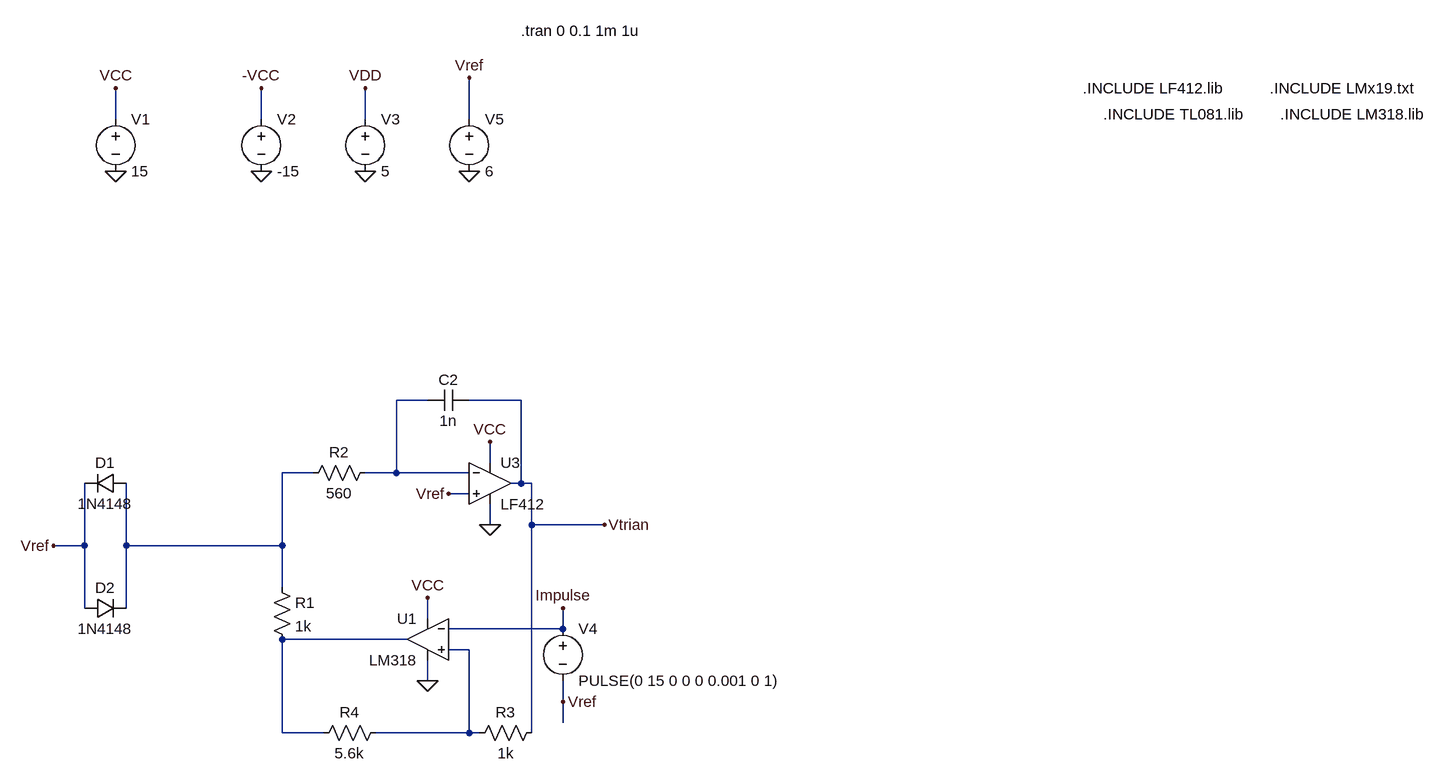
[diagram p0: schematic triangular.asc]
triangular.asc, the LTspice schematic file:
Version 4
SHEET 1 1084 1200
WIRE -1312 80 -1312 32
WIRE -1088 80 -1088 32
WIRE -928 80 -928 32
WIRE -768 80 -768 16
WIRE -832 512 -880 512
WIRE -688 512 -768 512
WIRE -736 608 -736 576
WIRE -1008 624 -1056 624
WIRE -880 624 -880 512
WIRE -880 624 -928 624
WIRE -768 624 -880 624
WIRE -688 640 -688 512
WIRE -688 640 -704 640
WIRE -672 640 -688 640
WIRE -768 656 -800 656
WIRE -736 704 -736 672
WIRE -672 704 -672 640
WIRE -560 704 -672 704
WIRE -1360 736 -1360 640
WIRE -1360 736 -1408 736
WIRE -1296 736 -1296 640
WIRE -1056 736 -1056 624
WIRE -1056 736 -1296 736
WIRE -1056 800 -1056 736
WIRE -1360 832 -1360 736
WIRE -1296 832 -1296 736
WIRE -832 848 -832 816
WIRE -624 864 -624 832
WIRE -624 864 -800 864
WIRE -864 880 -1056 880
WIRE -768 896 -800 896
WIRE -832 944 -832 912
WIRE -624 976 -624 944
WIRE -624 1008 -624 976
WIRE -1056 1024 -1056 880
WIRE -992 1024 -1056 1024
WIRE -768 1024 -768 896
WIRE -768 1024 -912 1024
WIRE -752 1024 -768 1024
WIRE -672 1024 -672 704
FLAG -1312 160 0
FLAG -1088 160 0
FLAG -1312 32 VCC
FLAG -1088 32 -VCC
FLAG -928 160 0
FLAG -928 32 VDD
FLAG -736 576 VCC
FLAG -832 816 VCC
FLAG -768 160 0
FLAG -768 16 Vref
FLAG -624 832 Impulse
FLAG -560 704 Vtrian
FLAG -1408 736 Vref
FLAG -800 656 Vref
FLAG -624 976 Vref
FLAG -736 704 0
FLAG -832 944 0
SYMBOL Opamps\\opamp2 -736 576 R0
SYMATTR InstName U3
SYMATTR Value LF412
SYMBOL cap -768 496 R90
WINDOW 0 0 32 VBottom 2
WINDOW 3 32 32 VTop 2
SYMATTR InstName C2
SYMATTR Value 1n
SYMBOL res -912 608 R90
WINDOW 0 0 56 VBottom 2
WINDOW 3 32 56 VTop 2
SYMATTR InstName R2
SYMATTR Value 560
SYMBOL res -656 1008 R90
WINDOW 0 0 56 VBottom 2
WINDOW 3 32 56 VTop 2
SYMATTR InstName R3
SYMATTR Value 1k
SYMBOL res -896 1008 R90
WINDOW 0 0 56 VBottom 2
WINDOW 3 32 56 VTop 2
SYMATTR InstName R4
SYMATTR Value 5.6k
SYMBOL voltage -1312 64 R0
WINDOW 123 0 0 Left 2
WINDOW 39 0 0 Left 2
SYMATTR InstName V1
SYMATTR Value 15
SYMBOL voltage -1088 64 R0
WINDOW 123 0 0 Left 2
WINDOW 39 0 0 Left 2
SYMATTR InstName V2
SYMATTR Value -15
SYMBOL voltage -928 64 R0
WINDOW 123 0 0 Left 2
WINDOW 39 0 0 Left 2
SYMATTR InstName V3
SYMATTR Value 5
SYMBOL voltage -624 848 R0
WINDOW 123 0 0 Left 2
WINDOW 39 0 0 Left 2
SYMATTR InstName V4
SYMATTR Value PULSE(0 15 0 0 0 0.001 0 1)
SYMBOL voltage -768 64 R0
WINDOW 123 0 0 Left 2
WINDOW 39 0 0 Left 2
SYMATTR InstName V5
SYMATTR Value 6
SYMBOL diode -1296 624 R90
WINDOW 0 0 32 VBottom 2
WINDOW 3 32 32 VTop 2
SYMATTR InstName D1
SYMATTR Value 1N4148
SYMBOL diode -1360 848 R270
WINDOW 0 32 32 VTop 2
WINDOW 3 0 32 VBottom 2
SYMATTR InstName D2
SYMATTR Value 1N4148
SYMBOL res -1072 784 R0
SYMATTR InstName R1
SYMATTR Value 1k
SYMBOL Opamps\\opamp2 -832 816 M0
SYMATTR InstName U1
SYMATTR Value LM318
TEXT 176 32 Left 2 !.INCLUDE LF412.lib
TEXT 464 32 Left 2 !.INCLUDE LMx19.txt
TEXT -688 -56 Left 2 !.tran 0 0.1 1m 1u
TEXT 208 72 Left 2 !.INCLUDE TL081.lib
TEXT 480 72 Left 2 !.INCLUDE LM318.lib

The netlist it stands for:
* triangular.asc
XU3 Vref N001 VCC 0 Vtrian LF412  ; pins In+ In- V+ V- OUT
C2 Vtrian N001 1n
R2 N001 N002 560
R3 Vtrian N004 1k
R4 N004 N003 5.6k
V1 VCC 0 15
V2 -VCC 0 -15
V3 VDD 0 5
V4 Impulse Vref PULSE(0 15 0 0 0 0.001 0 1)
V5 Vref 0 6
D1 N002 Vref 1N4148
D2 Vref N002 1N4148
R1 N002 N003 1k
XU1 N004 Impulse VCC 0 N003 LM318  ; pins In+ In- V+ V- OUT
.model D D
.lib standard.dio
.INCLUDE LF412.lib
.INCLUDE LMx19.txt
.tran 0 0.1 1m 1u
.INCLUDE TL081.lib
.INCLUDE LM318.lib
.backanno
.end